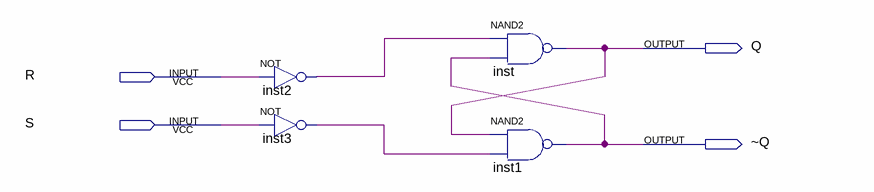
[diagram p0: schematic sheet]
// Quartus schematic lab9step1p2.bdf as structural Verilog: 4 symbols, 4 pins
module lab9step1p2 (
  input  R,
  input  S,
  output Q,
  output \~Q 
);

  wire inst2_out, inst3_out;

  not inst2 (inst2_out, R);
  not inst3 (inst3_out, S);
  nand inst (Q, inst2_out, \~Q );
  nand inst1 (\~Q , Q, inst3_out);
endmodule
